# Altium schematic sheet Memory.SchDoc
size A4; SheetNumber: 5; SheetTotal: 8
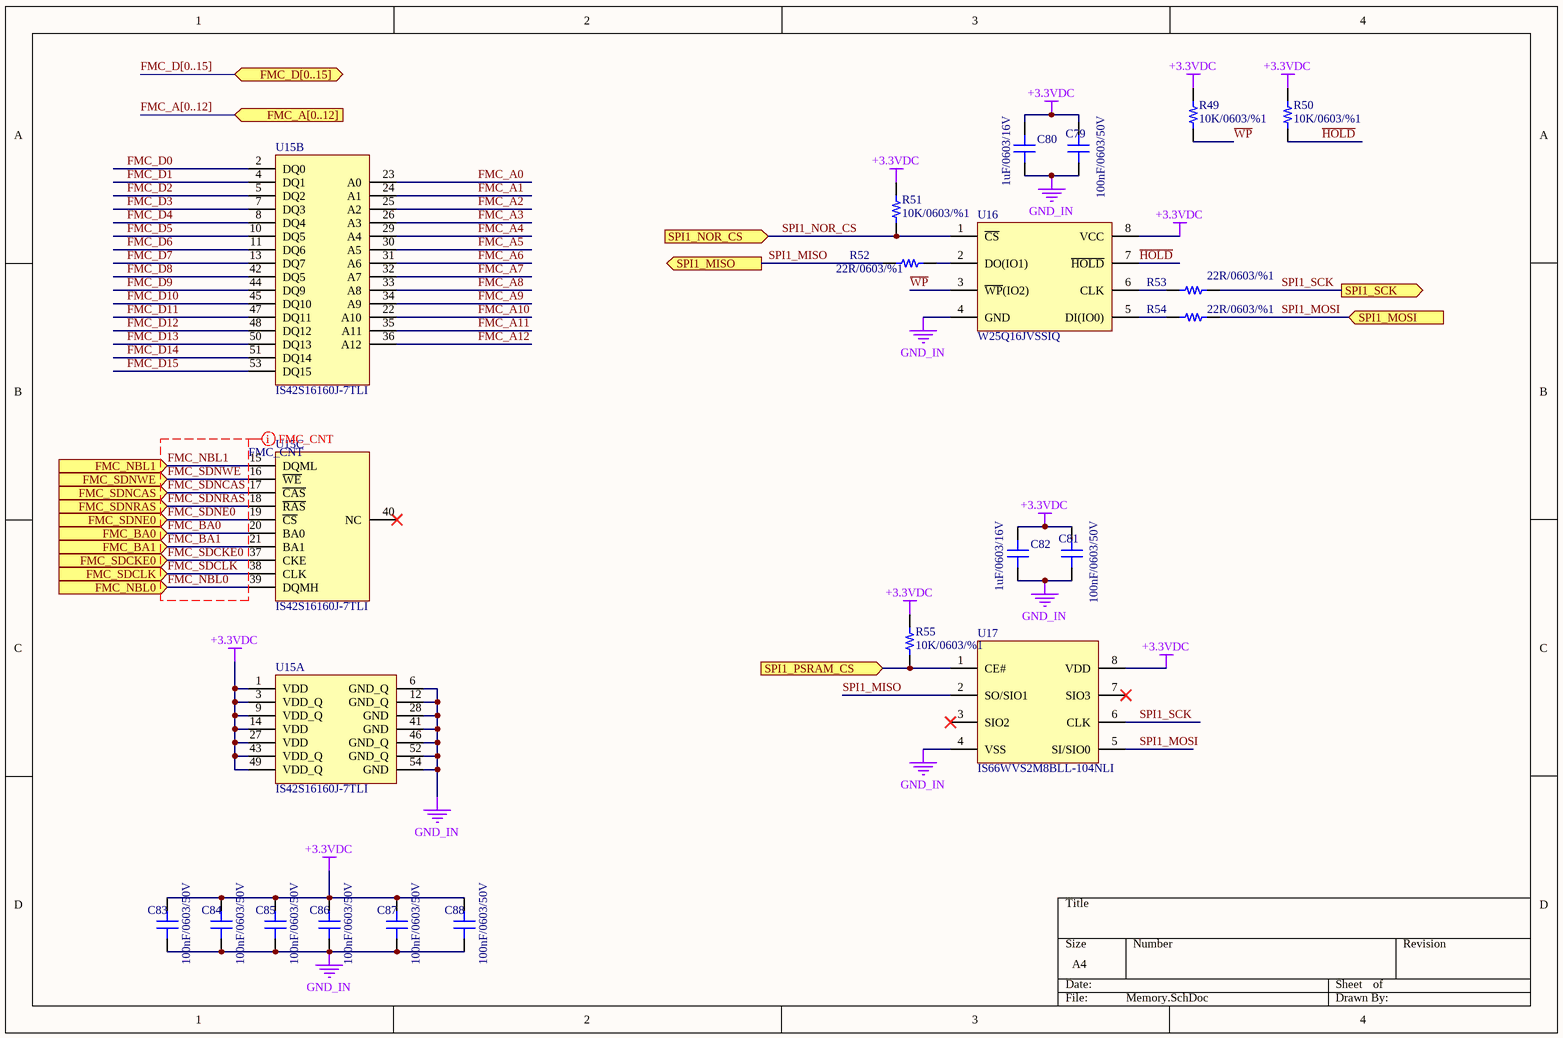
[diagram p0: Memory.SchDoc]

## Parts
C79  100nF/0603/50V  [0603_cap]
C80  1uF/0603/16V  [0603_cap]
C81  100nF/0603/50V  [0603_cap]
C82  1uF/0603/16V  [0603_cap]
C83  100nF/0603/50V  [0603_cap]
C84  100nF/0603/50V  [0603_cap]
C85  100nF/0603/50V  [0603_cap]
C86  100nF/0603/50V  [0603_cap]
C87  100nF/0603/50V  [0603_cap]
C88  100nF/0603/50V  [0603_cap]
R49  10K/0603/%1  [0603_res]
R50  10K/0603/%1  [0603_res]
R51  10K/0603/%1  [0603_res]
R52  22R/0603/%1  [0603_res]
R53  22R/0603/%1  [0603_res]
R54  22R/0603/%1  [0603_res]
R55  10K/0603/%1  [0603_res]
U15  IS42S16160J-7TLI  [TSOP-II-54]  (parts A,B,C of 3)
U16  W25Q16JVSSIQ  [8-SOIC (0.209", 5.30mm Width)]
U17  IS66WVS2M8BLL-104NLI  [SOIC-8(3.90MM)]

## Ports
FMC_A[0..12] (in, see Main[2B], MCU[2A]), FMC_BA0 (in, see Main[2C], MCU[2A]), FMC_BA1 (in, see Main[2C], MCU[2A]), FMC_D[0..15] (bidir, see Main[2B], MCU[2A]), FMC_NBL0 (in, see Main[2C], MCU[2A]), FMC_NBL1 (in, see Main[2C], MCU[2A]), FMC_SDCKE0 (in, see Main[2C], MCU[2A]), FMC_SDCLK (in, see Main[2C], MCU[2A]), FMC_SDNCAS (in, see Main[2C], MCU[2A]), FMC_SDNE0 (in, see Main[2C], MCU[2A]), FMC_SDNRAS (in, see Main[2C], MCU[2A]), FMC_SDNWE (in, see Main[2C], MCU[2A]), SPI1_MISO (out, see Main[2C], MCU[3A]), SPI1_MOSI (in, see Main[2C], MCU[3A]), SPI1_NOR_CS (in, see Main[2C], MCU[3A]), SPI1_PSRAM_CS (in, see Main[2C], MCU[3A]), SPI1_SCK (out, see Main[2C], MCU[3A])

## Nets
+3.3VDC: C79.1 C80.2 C81.1 C82.2 C83.1 C84.1 C85.1 C86.1 C87.1 C88.1 R49.1 R50.1 R51.1 R55.1 U15.1(VDD) U15.3(VDD_Q) U15.9(VDD_Q) U15.14(VDD) U15.27(VDD) U15.43(VDD_Q) U15.49(VDD_Q) U16.8(VCC) U17.8(VDD)
GND_IN: C79.2 C80.1 C81.2 C82.1 C83.2 C84.2 C85.2 C86.2 C87.2 C88.2 U15.6(GND_Q) U15.12(GND_Q) U15.28(GND) U15.41(GND) U15.46(GND_Q) U15.52(GND_Q) U15.54(GND) U16.4(GND) U17.4(VSS)
~{HOLD}: R50.2 U16.7(~{HOLD})
~{WP}: R49.2 U16.3(~{WP}(IO2))
FMC_A0: U15.23(A0)
FMC_A1: U15.24(A1)
FMC_A2: U15.25(A2)
FMC_A3: U15.26(A3)
FMC_A4: U15.29(A4)
FMC_A5: U15.30(A5)
FMC_A6: U15.31(A6)
FMC_A7: U15.32(A7)
FMC_A8: U15.33(A8)
FMC_A9: U15.34(A9)
FMC_A10: U15.22(A10)
FMC_A11: U15.35(A11)
FMC_A12: U15.36(A12)
FMC_BA0: U15.20(BA0) ; port FMC_BA0
FMC_BA1: U15.21(BA1) ; port FMC_BA1
FMC_D0: U15.2(DQ0)
FMC_D1: U15.4(DQ1)
FMC_D2: U15.5(DQ2)
FMC_D3: U15.7(DQ3)
FMC_D4: U15.8(DQ4)
FMC_D5: U15.10(DQ5)
FMC_D6: U15.11(DQ6)
FMC_D7: U15.13(DQ7)
FMC_D8: U15.42(DQ5)
FMC_D9: U15.44(DQ9)
FMC_D10: U15.45(DQ10)
FMC_D11: U15.47(DQ11)
FMC_D12: U15.48(DQ12)
FMC_D13: U15.50(DQ13)
FMC_D14: U15.51(DQ14)
FMC_D15: U15.53(DQ15)
FMC_NBL0: U15.39(DQMH) ; port FMC_NBL0
FMC_NBL1: U15.15(DQML) ; port FMC_NBL1
FMC_SDCKE0: U15.37(CKE) ; port FMC_SDCKE0
FMC_SDCLK: U15.38(CLK) ; port FMC_SDCLK
FMC_SDNCAS: U15.17(~{CAS}) ; port FMC_SDNCAS
FMC_SDNE0: U15.19(~{CS}) ; port FMC_SDNE0
FMC_SDNRAS: U15.18(~{RAS}) ; port FMC_SDNRAS
FMC_SDNWE: U15.16(~{WE}) ; port FMC_SDNWE
SPI1_MISO: R52.1 U17.2(SO/SIO1) ; port SPI1_MISO
SPI1_MOSI: R54.2 U17.5(SI/SIO0) ; port SPI1_MOSI
SPI1_NOR_CS: R51.2 U16.1(~{CS}) ; port SPI1_NOR_CS
SPI1_PSRAM_CS: R55.2 U17.1(CE#) ; port SPI1_PSRAM_CS
SPI1_SCK: R53.2 U17.6(CLK) ; port SPI1_SCK
NetR52_2: R52.2 U16.2(DO(IO1))
NetR53_1: R53.1 U16.6(CLK)
NetR54_1: R54.1 U16.5(DI(IO0))

Not connected (* = marked no-connect by the designer): U15 40(NC)*; U17 3(SIO2)* 7(SIO3)*

## Buses and harness runs
bus FMC_A[0..12] = port FMC_A[0..12]
bus FMC_D[0..15] = port FMC_D[0..15]

## Layout directives
net class FMC_CNT: FMC_BA0, FMC_BA1, FMC_NBL0, FMC_NBL1, FMC_SDCKE0, FMC_SDCLK, FMC_SDNCAS, FMC_SDNE0, FMC_SDNRAS, FMC_SDNWE

## Library data of the parts
C79-C88 = Capacitor: HelpURL: *; PN: *; Assembly: *
  C79 C81 C83-C88: Value: 100nF/0603/50V
  C80 C82: Value: 1uF/0603/16V
R49-R55 = RES: Assembly: .; HelpURL: *; PN: *
  R49-R51 R55: Value: 10K/0603/%1
  R52-R54: Value: 22R/0603/%1
U15 = IS42S16160J-7TLI: SDRAM Memory IC 256Mbit Parallel 143 MHz 5.4 ns 54-TSOP II; Assembly: .; Value: IS42S16160J-7TLI; PN: IS42S16160J-7TLI; HelpURL: https://www.digikey.com/en/products/detail/issi-integrated-silicon-solution-inc/IS42S16160J-7TLI/5319798
U16 = W25Q16JVSSIQ: FLASH - NOR Memory IC 16Mbit SPI - Quad I/O 133 MHz 8-SOIC; Assembly: .; Value: W25Q16JVSSIQ; PN: W25Q16JVSSIQ; HelpURL: https://www.digikey.com/en/products/detail/winbond-electronics/W25Q16JVSSIQ/6193769
U17 = IS66WVS2M8BLL-104NLI: PSRAM (Pseudo SRAM) Memory IC 16Mbit SPI, QPI 104 MHz 7 ns 8-SOIC; Assembly: .; Value: IS66WVS2M8BLL-104NLI; PN: IS66WVS2M8BLL-104NLI; HelpURL: https://www.digikey.com/en/products/detail/issi-integrated-silicon-solution-inc/IS66WVS2M8BLL-104NLI/16260610